# EAGLE design GEN_CART_EPROM_only (EAGLE 7.4.0)
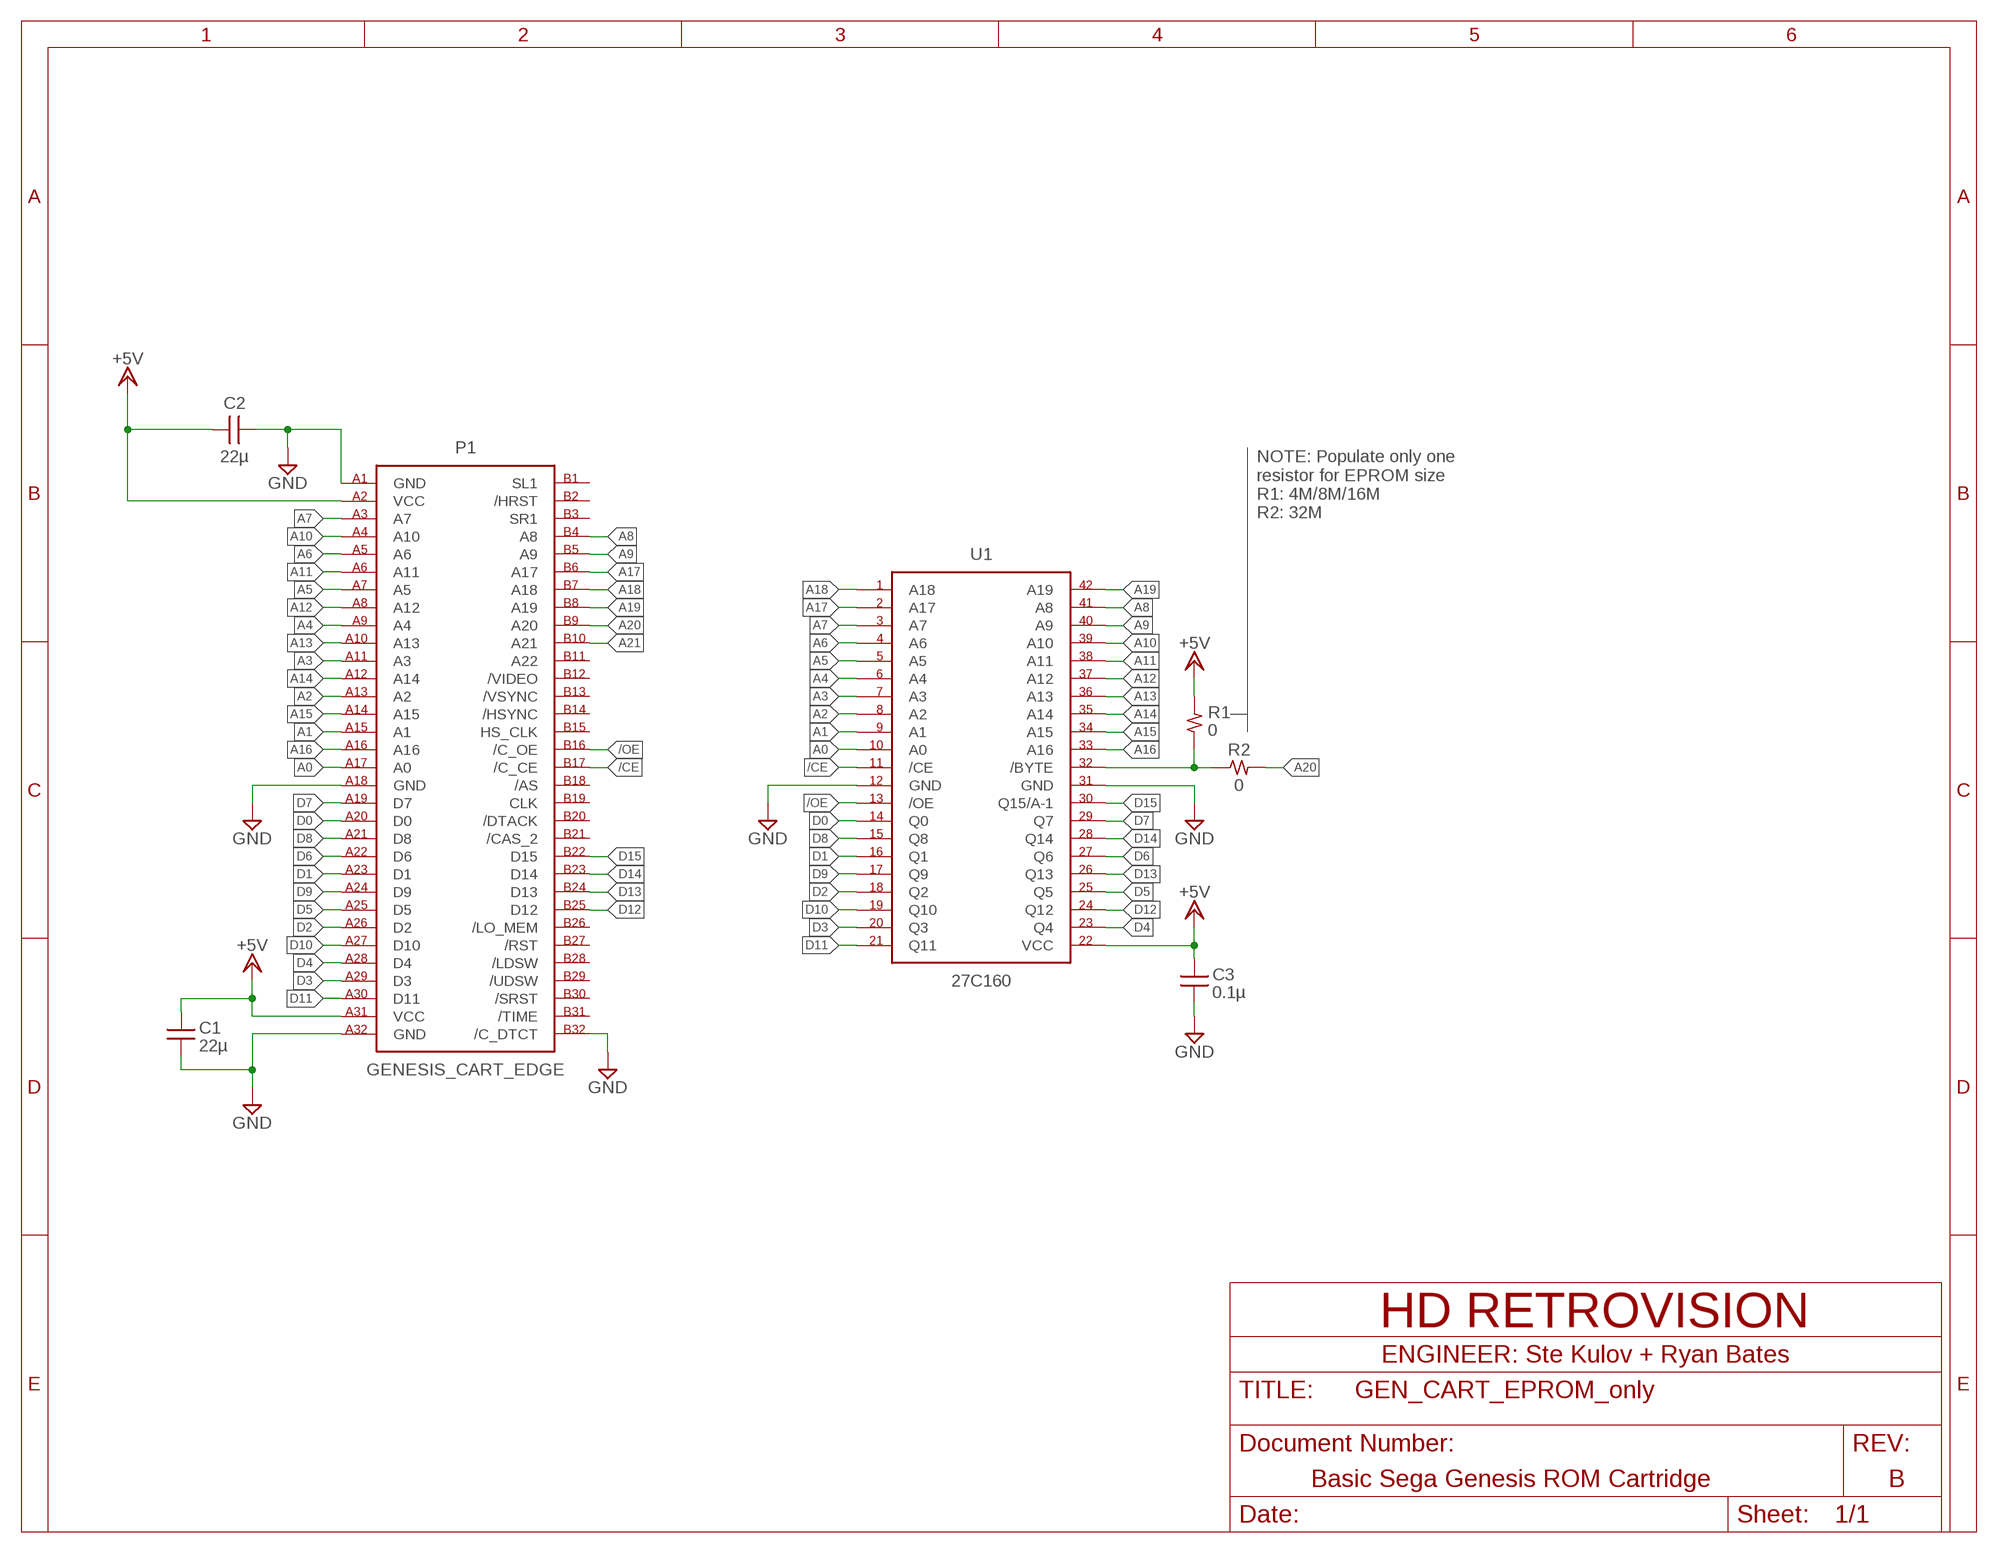
[diagram p0: schematic, sheet 1]

## Parts
C1  22µ  CAP_SMD1210  [CAP_SMD1210]
C2  22µ  CAP_SMD_HORIZONTAL1210  [CAP_SMD1210]
C3  0.1µ  CAP_SMD1210  [CAP_SMD1210]
P1  GENESIS_CART_EDGE  [GENESIS_CART_EDGE]
R1  0  RES_SMD0603  [RES_SMD0603]
R2  0  RES_SMD_HORIZONTAL0603  [RES_SMD0603]
U1  27C160  [DIP_600MIL_42]

## Nets
/CE: P1.B17(/C_CE) U1.P$11(/CE)
/OE: P1.B16(/C_OE) U1.P$13(/OE)
A0: P1.A17(A0) U1.P$10(A0)
A1: P1.A15(A1) U1.P$9(A1)
A2: P1.A13(A2) U1.P$8(A2)
A3: P1.A11(A3) U1.P$7(A3)
A4: P1.A9(A4) U1.P$6(A4)
A5: P1.A7(A5) U1.P$5(A5)
A6: P1.A5(A6) U1.P$4(A6)
A7: P1.A3(A7) U1.P$3(A7)
A8: P1.B4(A8) U1.P$41(A8)
A9: P1.B5(A9) U1.P$40(A9)
A10: P1.A4(A10) U1.P$39(A10)
A11: P1.A6(A11) U1.P$38(A11)
A12: P1.A8(A12) U1.P$37(A12)
A13: P1.A10(A13) U1.P$36(A13)
A14: P1.A12(A14) U1.P$35(A14)
A15: P1.A14(A15) U1.P$34(A15)
A16: P1.A16 U1.P$33(A16)
A17: P1.B6(A17) U1.P$2(A17)
A18: P1.B7(A18) U1.P$1(A18)
A19: P1.B8(A19) U1.P$42(A19)
A20: P1.B9(A20) R2.P$2
A21: P1.B10(A21)
D0: P1.A20(D0) U1.P$14(Q0)
D1: P1.A23(D1) U1.P$16(Q1)
D2: P1.A26(D2) U1.P$18(Q2)
D3: P1.A29(D3) U1.P$20(Q3)
D4: P1.A28(D4) U1.P$23(Q4)
D5: P1.A25(D5) U1.P$25(Q5)
D6: P1.A22(D6) U1.P$27(Q6)
D7: P1.A19(D7) U1.P$29(Q7)
D8: P1.A21(D8) U1.P$15(Q8)
D9: P1.A24(D9) U1.P$17(Q9)
D10: P1.A27(D10) U1.P$19(Q10)
D11: P1.A30(D11) U1.P$21(Q11)
D12: P1.B25(D12) U1.P$24(Q12)
D13: P1.B24(D13) U1.P$26(Q13)
D14: P1.B23(D14) U1.P$28(Q14)
D15: P1.B22(D15) U1.P$30(Q15/A-1)
GND: C1.P$1 C2.P$1 C3.P$1 P1.A1(GND) P1.A18(GND) P1.A32(GND) P1.B32(/C_DTCT) U1.P$12(GND) U1.P$31(GND)
N$5: R1.P$1 R2.P$1 U1.P$32(/BYTE)
V+: C1.P$2 C2.P$2 C3.P$2 P1.A2(VCC) P1.A31(VCC) R1.P$2 U1.P$22(VCC) ; supply symbol labelled +5V
Unconnected: P1.B1(SL1) P1.B2(/HRST) P1.B3(SR1) P1.B11(A22) P1.B12(/VIDEO) P1.B13(/VSYNC) P1.B14(/HSYNC) P1.B15(HS_CLK) P1.B18(/AS) P1.B19(CLK) P1.B20(/DTACK) P1.B21(/CAS_2) P1.B26(/LO_MEM) P1.B27(/RST) P1.B28(/LDSW) P1.B29(/UDSW) P1.B30(/SRST) P1.B31(/TIME)

## Notes on the sheet
- NOTE: Populate only one
  resistor for EPROM size
  R1: 4M/8M/16M
  R2: 32M
- HD RETROVISION
- ENGINEER: Ste Kulov + Ryan Bates
- Basic Sega Genesis ROM Cartridge | B

## Library data of the parts
C1 C3 = hdretrovision:CAP_SMD
C2 = hdretrovision:CAP_SMD_HORIZONTAL
P1 = hdretrovision:GENESIS_CART_EDGE
R1 = hdretrovision:RES_SMD
R2 = hdretrovision:RES_SMD_HORIZONTAL
U1 = hdretrovision:27C160

## Board
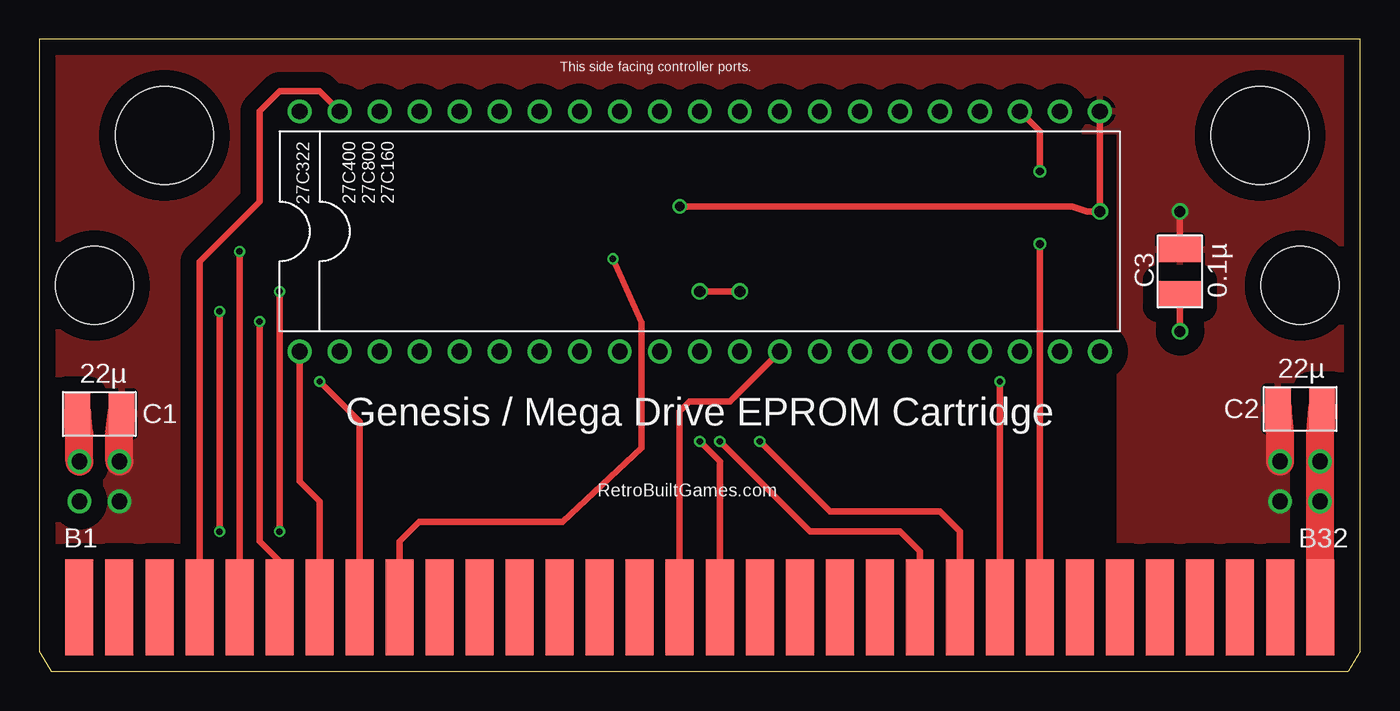
[diagram p1: board, top side]
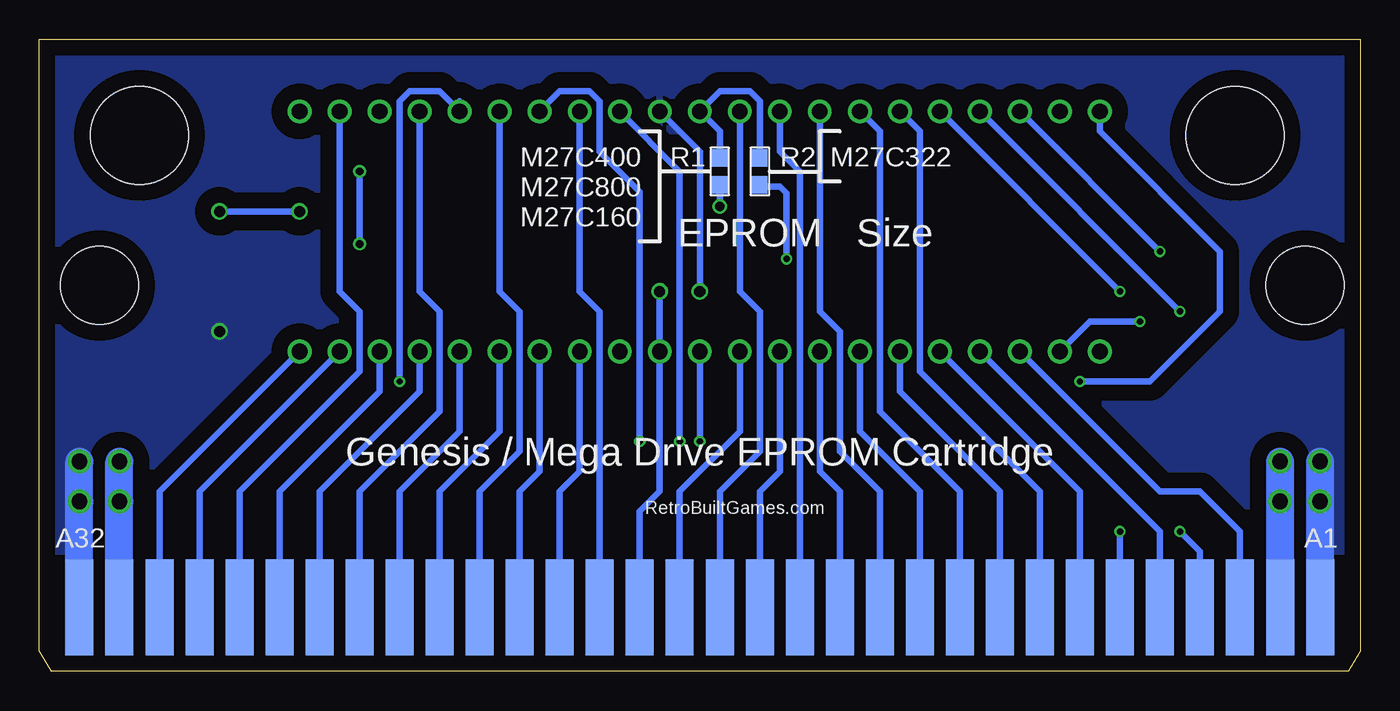
[diagram p2: board, bottom side, seen from below]

Size 83.82 x 40.13 mm. Coordinates in mm from the lower left corner, seen from the top.
Outline: 0.76,0 83.06,0 83.82,1.27 83.82,40.13 0,40.13 0,1.27 0.76,0
Copper layers (1*16): Top 0.035mm / dielectric 1.5mm / Bottom 0.035mm
Design rules "SeeedStudio_2layer_DRU_no_angle_20140221": minimum track width 6mil, minimum drill 12mil, track to track 6mil, track to pad 6mil, pad to pad 6mil, via to via 6mil, smd to smd 0mil, copper to edge 10mil, drill to drill 10mil, minimum pad ring 10mil, minimum via ring 6mil, stop-mask expansion 2mil, vias tented up to drill 100mil, thermal gap 10mil
Holes 6.22 mm at 7.94,34.04 77.47,34.04
Holes 4.95 mm at 3.49,24.51 80.01,24.51

### Footprints (pad centres in the part's own frame; a part is rotated, then mirrored left to right if it is on the bottom)
CAP_SMD1210 = smd 1.6 x 2.7: P$1 -1.4,0; P$2 1.4,0
GENESIS_CART_EDGE = smd 1.778 x 6.096 bottom: A1 -38.1,0; A2 -35.56,0; A3 -33.02,0; A4 -30.48,0; A5 -27.94,0; A6 -25.4,0; A7 -22.86,0; A8 -20.32,0; A9 -17.78,0; A10 -15.24,0; A11 -12.7,0; A12 -10.16,0; A13 -7.62,0; A14 -5.08,0; A15 -2.54,0; A16 0,0; A17 2.54,0; A18 5.08,0; A19 7.62,0; A20 10.16,0; A21 12.7,0; A22 15.24,0; A23 17.78,0; A24 20.32,0; A25 22.86,0; A26 25.4,0; A27 27.94,0; A28 30.48,0; A29 33.02,0; A30 35.56,0; A31 38.1,0; A32 40.64,0 | smd 1.778 x 6.096: B1 -38.1,0; B2 -35.56,0; B3 -33.02,0; B4 -30.48,0; B5 -27.94,0; B6 -25.4,0; B7 -22.86,0; B8 -20.32,0; B9 -17.78,0; B10 -15.24,0; B11 -12.7,0; B12 -10.16,0; B13 -7.62,0; B14 -5.08,0; B15 -2.54,0; B16 0,0; B17 2.54,0; B18 5.08,0; B19 7.62,0; B20 10.16,0; B21 12.7,0; B22 15.24,0; B23 17.78,0; B24 20.32,0; B25 22.86,0; B26 25.4,0; B27 27.94,0; B28 30.48,0; B29 33.02,0; B30 35.56,0; B31 38.1,0; B32 40.64,0
RES_SMD0603 = smd 1.1 x 1: P$1 -0.85,0; P$2 0.85,0
DIP_600MIL_42 = drill 1: P$1 -25.4,-7.62; P$2 -22.86,-7.62; P$3 -20.32,-7.62; P$4 -17.78,-7.62; P$5 -15.24,-7.62; P$6 -12.7,-7.62; P$7 -10.16,-7.62; P$8 -7.62,-7.62; P$9 -5.08,-7.62; P$10 -2.54,-7.62; P$11 0,-7.62; P$12 2.54,-7.62; P$13 5.08,-7.62; P$14 7.62,-7.62; P$15 10.16,-7.62; P$16 12.7,-7.62; P$17 15.24,-7.62; P$18 17.78,-7.62; P$19 20.32,-7.62; P$20 22.86,-7.62; P$21 25.4,-7.62; P$22 25.4,7.62; P$23 22.86,7.62; P$24 20.32,7.62; P$25 17.78,7.62; P$26 15.24,7.62; P$27 12.7,7.62; P$28 10.16,7.62; P$29 7.62,7.62; P$30 5.08,7.62; P$31 2.54,7.62; P$32 0,7.62; P$33 -2.54,7.62; P$34 -5.08,7.62; P$35 -7.62,7.62; P$36 -10.16,7.62; P$37 -12.7,7.62; P$38 -15.24,7.62; P$39 -17.78,7.62; P$40 -20.32,7.62; P$41 -22.86,7.62; P$42 -25.4,7.62

### Placement (x,y rotation side)
C1  3.81,16.35 0 top
C2  80.01,16.67 180 top
C3  72.39,25.4 90 top
P1  40.64,4.06 0 top
R1  40.64,31.75 270 bottom
R2  38.1,31.75 270 bottom
U1  41.91,27.94 0 top

### Tracks (layer width: path | path; a pad name or v marks a point on that pad's centre or on a via)
/CE  (via drill 0.4)
  Top 0.406: P1.B17 43.18,13.34 v41.91,14.61
  Bottom 0.406: v41.91,14.61 U1.P$11
/OE
  Top 0.406: P1.B16 40.64,16.51 41.27,17.14 43.81,17.14 U1.P$13
A0
  Bottom 0.406: P1.A17 43.18,11.43 39.37,15.24 U1.P$10
A1
  Bottom 0.406: P1.A15 38.1,11.43 36.83,12.7 U1.P$9
A2
  Bottom 0.406: P1.A13 33.02,11.43 34.29,12.7 U1.P$8
A3
  Bottom 0.406: P1.A11 27.94,11.43 31.75,15.24 U1.P$7
A4
  Bottom 0.406: P1.A9 22.86,11.43 29.21,17.78 U1.P$6
A5
  Bottom 0.406: P1.A7 17.78,11.43 U1.P$5
A6
  Bottom 0.406: P1.A5 12.7,8.89 U1.P$4
A7
  Bottom 0.406: P1.A3 7.62,8.89 10.16,11.43 12.7,11.43 U1.P$3
A8
  Top 0.406: P1.B4 10.16,26.04 13.97,29.84 13.97,35.56 15.24,36.83 17.78,36.83 U1.P$41
A9  (via drill 0.4)
  Top 0.406: P1.B5 v12.7,26.67
  Bottom 0.406: v12.7,26.67 U1.P$40
A10  (via drill 0.4)
  Top 0.406: v11.43,8.89 v11.43,22.86
  Bottom 0.406: P1.A4 10.16,7.62 v11.43,8.89 | v11.43,22.86 U1.P$39
A11  (via drill 0.4)
  Top 0.406: v15.24,8.89 v15.24,24.13
  Bottom 0.406: v15.24,24.13 U1.P$38 | P1.A6 v15.24,8.89
A12
  Bottom 0.406: P1.A8 20.32,11.43 27.94,19.05 27.94,34.29 U1.P$37
A13
  Bottom 0.406: P1.A10 25.4,11.43 30.48,16.51 30.48,34.29 U1.P$36
A14
  Bottom 0.406: P1.A12 30.48,11.43 33.02,13.97 33.02,21.59 34.29,22.86 U1.P$35
A15
  Bottom 0.406: P1.A14 35.56,31.75 36.83,33.02 U1.P$34
A16
  Bottom 0.406: P1.A16 40.64,11.43 38.1,13.97 38.1,22.86 39.37,24.13 U1.P$33
A17  (via drill 0.4)
  Top 0.406: P1.B6 15.24,6.99 13.97,8.26 v13.97,22.23
  Bottom 0.406: v13.97,22.23 17.14,22.23 U1.P$2
A18
  Top 0.406: P1.B7 17.78,10.79 16.51,12.06 U1.P$1
A19  (via drill 0.4)
  Top 0.406: P1.B8 20.32,15.88 v17.78,18.41
  Bottom 0.406: v17.78,18.41 13.34,18.41 8.89,22.86 8.89,26.67 16.51,34.29 U1.P$42
A20  (via drill 0.4)
  Top 0.406: P1.B9 22.86,8.26 24.1,9.5 33.2,9.5 38.22,14.2 38.22,22.16 v36.4,26.2
  Bottom 0.2: 38,30.8 R2.P$2
  Bottom 0.406: v36.4,26.2 36.4,30.37 36.83,30.8 38,30.8
D0
  Bottom 0.406: P1.A20 50.8,11.43 49.53,12.7 U1.P$14
D1
  Bottom 0.406: P1.A23 58.42,11.43 54.61,15.24 U1.P$16
D2
  Bottom 0.406: P1.A26 66.04,11.43 59.69,17.78 U1.P$18
D3
  Bottom 0.406: P1.A29 73.66,11.43 U1.P$20
D4
  Bottom 0.406: P1.A28 71.12,11.43 63.5,19.05 63.5,22.86 64.77,24.13 U1.P$23
D5
  Bottom 0.406: P1.A25 63.5,11.43 58.42,16.51 58.42,22.86 59.69,24.13 U1.P$25
D6
  Bottom 0.406: P1.A22 55.88,11.43 53.34,13.97 53.34,22.86 54.61,24.13 U1.P$27
D7
  Bottom 0.406: P1.A19 48.26,22.86 49.53,24.13 U1.P$29
D8
  Bottom 0.406: P1.A21 53.34,11.43 52.07,12.7 U1.P$15
D9
  Bottom 0.406: P1.A24 60.96,11.43 57.15,15.24 U1.P$17
D10
  Bottom 0.406: P1.A27 68.58,11.43 62.23,17.78 U1.P$19
D11
  Bottom 0.406: P1.A30 76.2,11.43 U1.P$21
D12  (via drill 0.5 pad 0.61)
  Top 0.406: P1.B25 v63.5,27.15 | v63.5,31.75 63.5,34.29 U1.P$24
  Bottom 0.406: v63.5,31.75 v63.5,27.15
D13  (via drill 0.4)
  Top 0.406: P1.B24 v60.96,18.41
  Bottom 0.406: v60.96,18.41 60.96,36.2 60.33,36.83 58.42,36.83 U1.P$26 57.15,36.2
D14  (via drill 0.4)
  Top 0.406: P1.B23 58.42,8.89 57.15,10.16 50.16,10.16 v45.72,14.61
  Bottom 0.406: v45.72,14.61 45.72,30.48 48.26,33.02 48.26,36.2 48.9,36.83 50.8,36.83 U1.P$28
D15  (via drill 0.4)
  Top 0.406: P1.B22 55.88,7.62 54.61,8.89 48.9,8.89 v43.18,14.61
  Bottom 0.406: v43.18,14.61 43.18,31.75 U1.P$30
GND  (via drill 0.7, 1)
  Top 0.406: C3.P$1 v72.39,21.59 | v41.91,24.13 v44.45,24.13
  Top 1.778: v2.54,13.34 2.54,15.11 C1.P$1 | C2.P$1 81.28,15.11 v81.28,13.34 v81.28,10.79 P1.B32
  Bottom 0.406: P1.A18 45.72,10.16 44.45,11.43 U1.P$12 v44.45,24.13 | U1.P$31 41.91,33.02 v41.91,24.13
  Bottom 1.778: P1.A1 v2.54,10.79 v2.54,13.34 | P1.B32 v81.28,10.79 v81.28,13.34
  pour Bottom (isolate 1.016): 0,7.62 0,40.13 83.82,40.13 83.82,7.62 55.88,7.62 55.88,34.29 27.94,34.29 27.94,7.62
N$5
  Bottom 0.406: R2.P$1 38.1,36.2 38.73,36.83 40.64,36.83 U1.P$32 40.64,34.29 R1.P$1
V+  (via drill 0.6, 0.7, 1)
  Top 0.2: v67.3,29.2 v67.31,29.21
  Top 0.406: U1.P$22 v67.31,29.21 | v72.39,29.21 C3.P$2 | v67.3,29.2 67.19,29.2 66.52,29.21 65.56,29.53 v40.64,29.53
  Top 1.778: v5.08,13.34 5.08,15.11 C1.P$2 | v78.74,13.34 78.74,15.11 C2.P$2
  Bottom 0.406: v67.31,29.21 v72.39,29.21 | v40.64,29.53 R1.P$2
  Bottom 1.778: P1.A2 v5.08,10.79 v5.08,13.34 | P1.A31 v78.74,10.79 v78.74,13.34
  pour Top (isolate 1.016): 0,7.62 0,40.13 83.82,40.13 83.82,7.62 68.58,7.62 68.58,34.29 15.24,34.29 15.24,7.62

### Text on the board
tPlace: This side facing controller ports. | 27C322 | 27C400 / 27C800 / 27C160 | Genesis / Mega Drive EPROM Cartridge | RetroBuiltGames.com | B1 | B32
bPlace: M27C322 | M27C400 / M27C800 / M27C160 | Size | EPROM | Genesis / Mega Drive EPROM Cartridge | RetroBuiltGames.com | A1 | A32